# EAGLE design unicorder-mk-1.3-base (EAGLE 6.5.0)
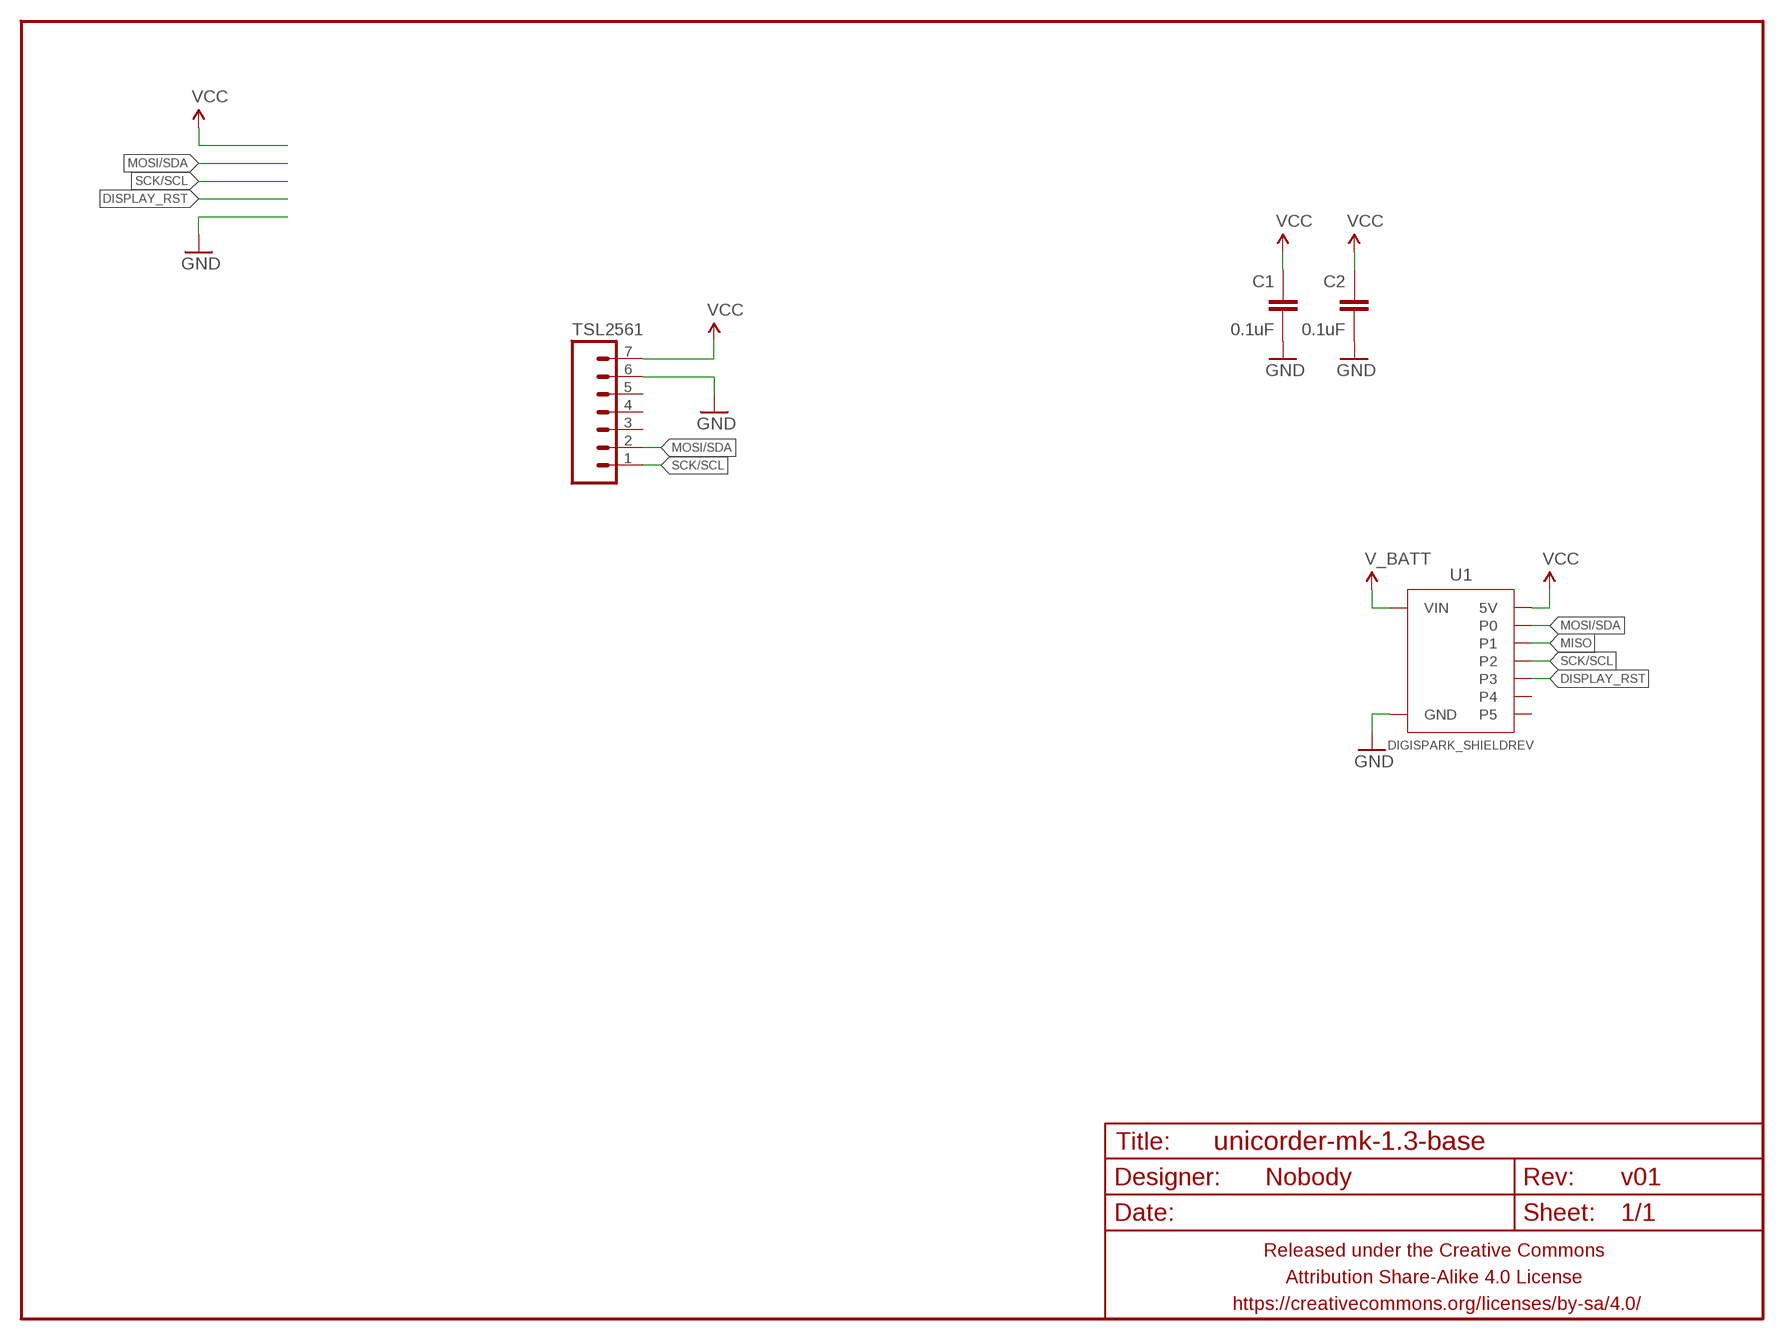
[diagram p0: schematic, sheet 1]

## Parts
C1  0.1uF  CAPACITOR-CERAMIC025-024X044  [C025-024X044]
C2  0.1uF  CAPACITOR-CERAMIC025-024X044  [C025-024X044]
FRAME1  FRAME-LETTERNO_PACKAGE  [DUMMY]
TSL2561  M07PTH-SLIMASS  [1X07_PTH_SLIMASS]
U1  DIGISPARK_SHIELDREV  [DIGISPARK_SHIELD_REV]

## Nets
DISPLAY_RST: U1.P3
GND: C1.2 C2.2 TSL2561.6 U1.GND
MISO: U1.P1
MOSI/SDA: TSL2561.2 U1.P0
SCK/SCL: TSL2561.1 U1.P2
V_BATT: U1.VIN
VCC: C1.1 C2.1 TSL2561.7 U1.5V
Unconnected: TSL2561.3 TSL2561.4 TSL2561.5 U1.P4 U1.P5

## Library data of the parts
C1 C2 = A_butts:CAPACITOR-CERAMIC: CAPACITOR, European symbol
FRAME1 = A_butts:FRAME-LETTER: Schematic Frame Standard 8.5x11 US Letter frame; DESIGNER: Nobody; VERSION: v01
TSL2561 = A_butts:M07: Header 7 Standard 7-pin 0.1" header. Use with straight break away headers (SKU : PRT-00116), right angle break away headers (PRT-00553), swiss pins (PRT-00743), machine pins (PRT-00117), and female headers (PRT-00115). NOTES ON THE VARIANTS LOCK and LOCK_LONGPADS... This footprint was designed to help hold the alignment of a through-hole component (i.e. 7-pin header) while soldering it into place. You may notice that each hole has been shifted either up or down by 0.005 of an inch from it's more standard position (which is usually a perfectly straight line). This slight alteration caused the pins (the squares in the middle) to touch the edges of the holes. Because they are alternating, it causes a "brace" to hold the header in place. 0.005 has proven to be the perfect amount of "off-center" position when using our standard breakaway headers. Although looks a little odd when you look at the bare footprint, once you have a header in there, the alteration is very hard to notice. Also, if you push a header all the way into place, it is covered up entirely on the bottom side. This idea of altering the position of holes to aid alignment will be further integrated into the Sparkfun Library for other footprints. It can help hold any component with 3 or more connection pins.
U1 = A_butts:DIGISPARK_SHIELD

## Board
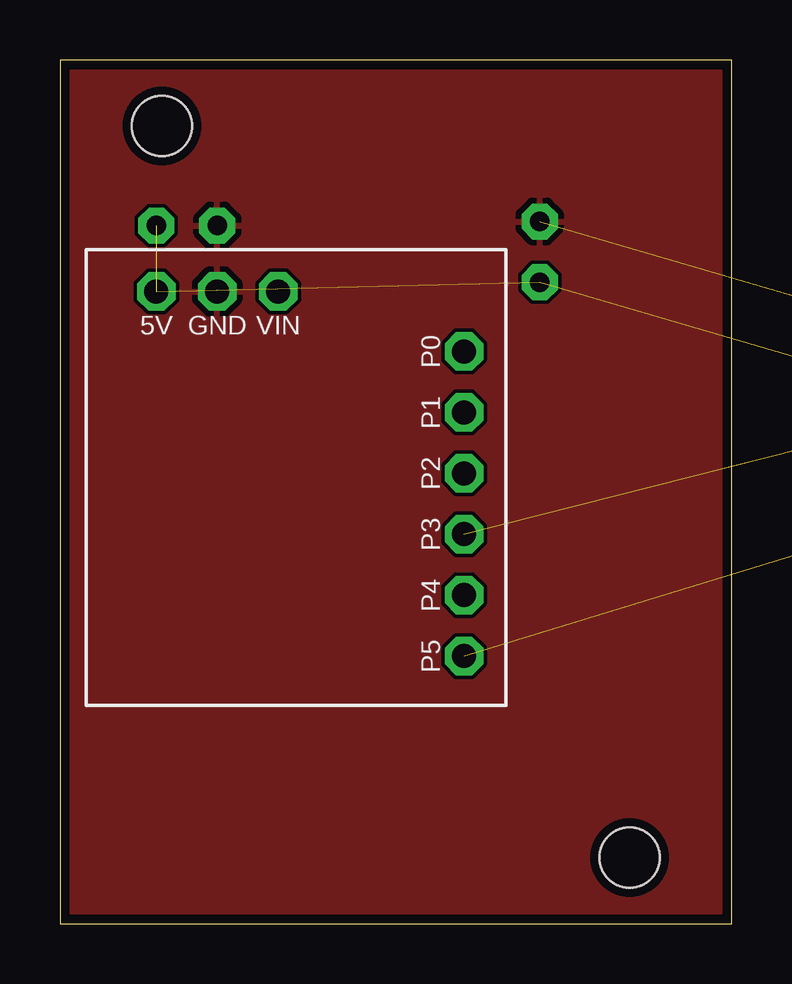
[diagram p1: board, top side]
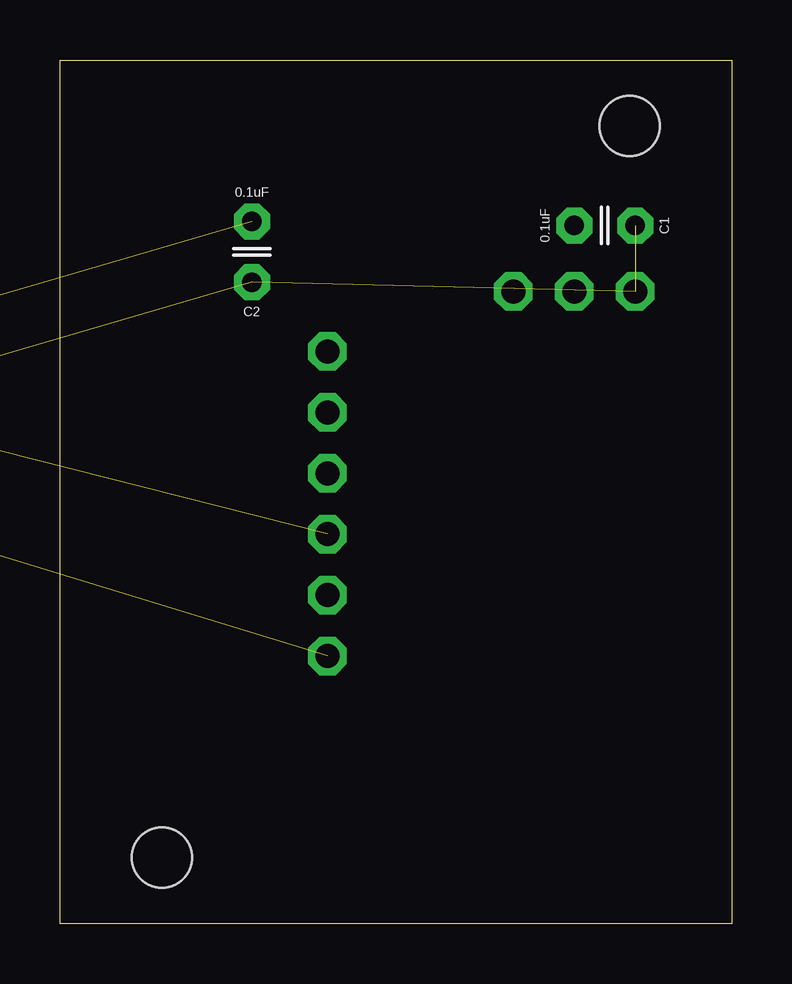
[diagram p2: board, bottom side, seen from below]

Size 28 x 36 mm. Coordinates in mm from the lower left corner, seen from the top.
Outline: 0,36 0,0 28,0 28,36 0,36
Copper layers (1*16): Top 0.0356mm / dielectric 1.5011mm / Bottom 0.0356mm
Design rules "LaenPCBOrder_2": minimum track width 6mil, minimum drill 13mil, track to track 6mil, track to pad 6mil, pad to pad 6mil, via to via 6mil, smd to smd 6mil, copper to edge 15mil, drill to drill 6mil, minimum pad ring 7mil, minimum via ring 7mil, stop-mask expansion 3mil, vias tented up to drill 20mil, thermal gap 10mil
Holes 2.5 mm at 4.25,33.25 23.75,2.75

### Footprints (pad centres in the part's own frame; a part is rotated, then mirrored left to right if it is on the bottom)
C025-024X044 = drill 0.813 pad 1.5 octagon: 1 -1.27,0; 2 1.27,0
1X07_PTH_SLIMASS = drill 1.2 pad 1.9 octagon: 1 0,0; 2 2.54,0; 3 5.08,0; 4 7.62,0; 5 10.16,0; 6 12.7,0; 7 15.24,0
DIGISPARK_SHIELD_REV = drill 1 pad 1.6 octagon: 5V -5.83,-7.75; GND -3.29,-7.75; P0 7,7.45; P1 7,4.91; P2 7,2.37; P3 7,-0.17; P4 7,-2.71; P5 7,-5.25; VIN -0.75,-7.75

### Placement (x,y rotation side)
C1  5.29,29.1 180 bottom
C2  20,28 90 bottom
FRAME1  -0.6,0 0 top
TSL2561  65.7,28.62 270 bottom  (outside the outline)
U1  9.85,18.6 180 bottom

### Tracks (layer width: path | path; a pad name or v marks a point on that pad's centre or on a via)
GND  (1 unrouted)
  pour Top: -0.1,-0.1 -0.1,36.1 28.1,36.1 28.1,-0.1
MOSI/SDA  (1 unrouted)
SCK/SCL  (1 unrouted)
VCC  (3 unrouted)

### Text on the board
bPlace: SCL | SDA | INT | ADDR | 3Vo | GND | VIN